# Altium schematic sheet wifi.SchDoc
size A portrait; SheetNumber: 2; SheetTotal: 2
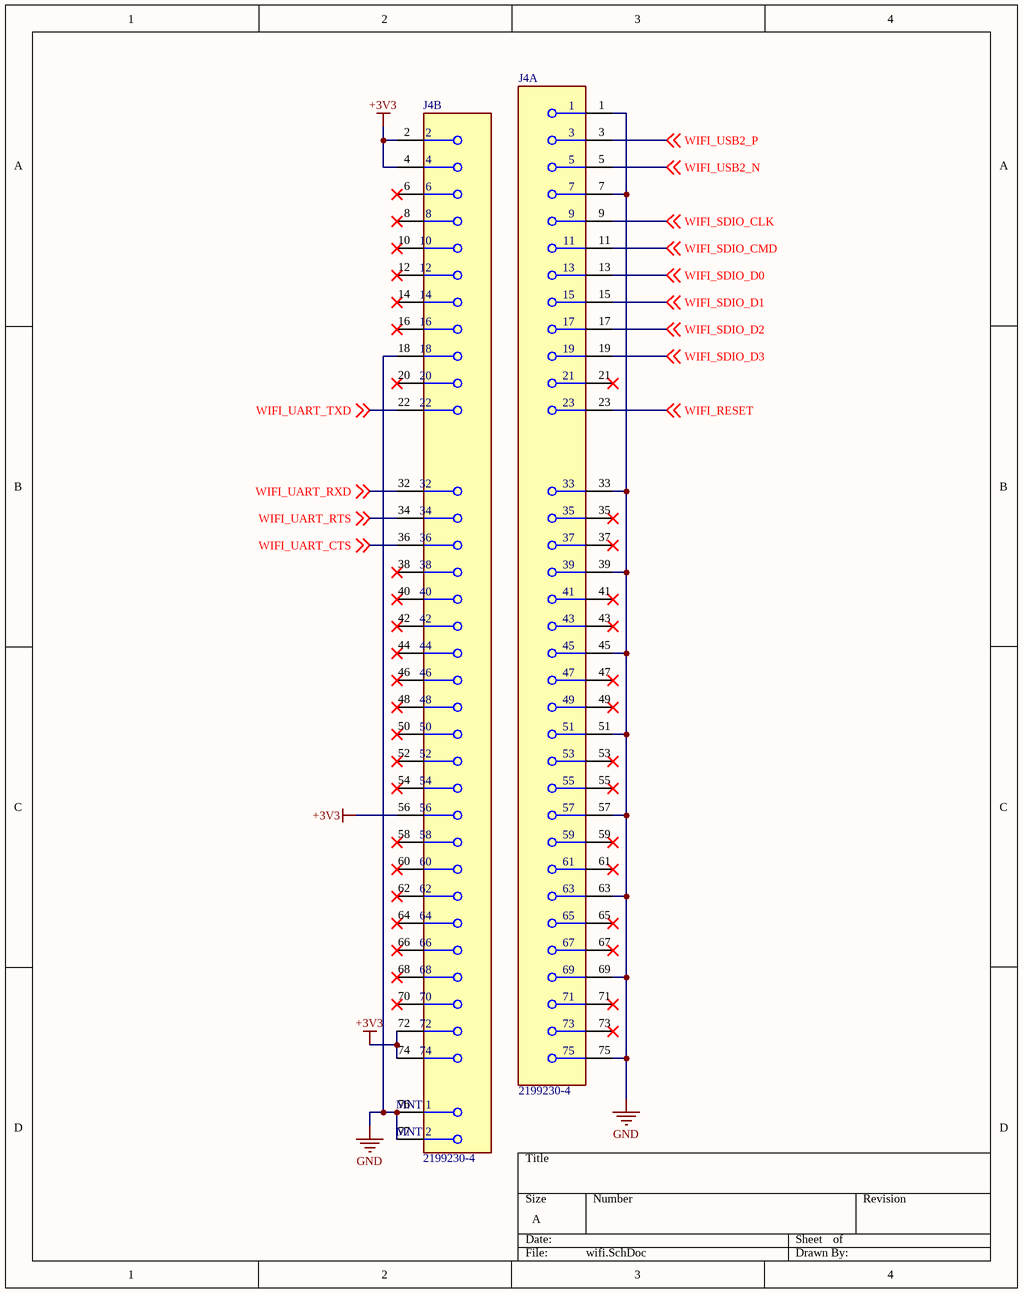
[diagram p0: wifi.SchDoc]

## Parts
J4  2199230-4  [FP-2199230-4-MFG]  (parts A,B of 2)

## Nets
+3V3: J4.2 J4.4 J4.56 J4.72 J4.74
GND: J4.1 J4.7 J4.18 J4.33 J4.39 J4.45 J4.51 J4.57 J4.63 J4.69 J4.75 J4.76(MNT_1) J4.77(MNT_2)
WIFI_RESET: J4.23 ; off-sheet WIFI_RESET
WIFI_SDIO_CLK: J4.9 ; off-sheet WIFI_SDIO_CLK
WIFI_SDIO_CMD: J4.11 ; off-sheet WIFI_SDIO_CMD
WIFI_SDIO_D0: J4.13 ; off-sheet WIFI_SDIO_D0
WIFI_SDIO_D1: J4.15 ; off-sheet WIFI_SDIO_D1
WIFI_SDIO_D2: J4.17 ; off-sheet WIFI_SDIO_D2
WIFI_SDIO_D3: J4.19 ; off-sheet WIFI_SDIO_D3
WIFI_UART_CTS: J4.36 ; off-sheet WIFI_UART_CTS
WIFI_UART_RTS: J4.34 ; off-sheet WIFI_UART_RTS
WIFI_UART_RXD: J4.32 ; off-sheet WIFI_UART_RXD
WIFI_UART_TXD: J4.22 ; off-sheet WIFI_UART_TXD
WIFI_USB2_N: J4.5 ; off-sheet WIFI_USB2_N
WIFI_USB2_P: J4.3 ; off-sheet WIFI_USB2_P

Not connected (* = marked no-connect by the designer): J4 6* 8* 10* 12* 14* 16* 20* 21* 35* 37* 38* 40* 41* 42* 43* 44* 46* 47* 48* 49* 50* 52* 53* 54* 55* 58* 59* 60* 61* 62* 64* 65* 66* 67* 68* 70* 71* 73*

## Library data of the parts
J4 = CMP-03365-000002-1: CONN FEMALE 67POS 0.020 GOLD; Manufacturer: TE Connectivity; Conn Orientation: Right Angle; Pitch: 0.5mm; Number Of Contacts: 67; Voltage Rating: 50V; Is Female: yes; Current Rating: 0.5A; Lead Free: Yes; Temperature Range Low: -40°C; Device Class L3: unset; Package: 0; Manufacturer Part Number: 2199230-4; RoHS: TRUE; Digikey Description: CONN FEMALE 67POS 0.020 GOLD; Category: Conn; Device Class L1: Connectors; Temperature Range High: +80°C; ComponentLink2Description: Datasheet; ComponentLink2URL: https://www.te.com/commerce/DocumentDelivery/DDEController?Action=showdoc&DocId=Customer+Drawing%7F2199230%7FB3%7Fpdf%7FEnglish%7FENG_CD_2199230_B3.pdf%7F2199230-4; Mouser Description: PCI Express / PCI Connectors .5PITCH 4.2H KEY E EMBOSS NGFF MINICARD; Automotive: No; Conn Gender: Female; Height: 4.2mm; Device Class L2: Card Edge Connectors; Contact Material: Gold,Nickel; Number Of Rows: 2; Octopart: https://octopart.com/2199230-4-te+connectivity-46436156; Temperature: -40°C to +80°C